# EAGLE schematic Test (EAGLE 7.7.0)
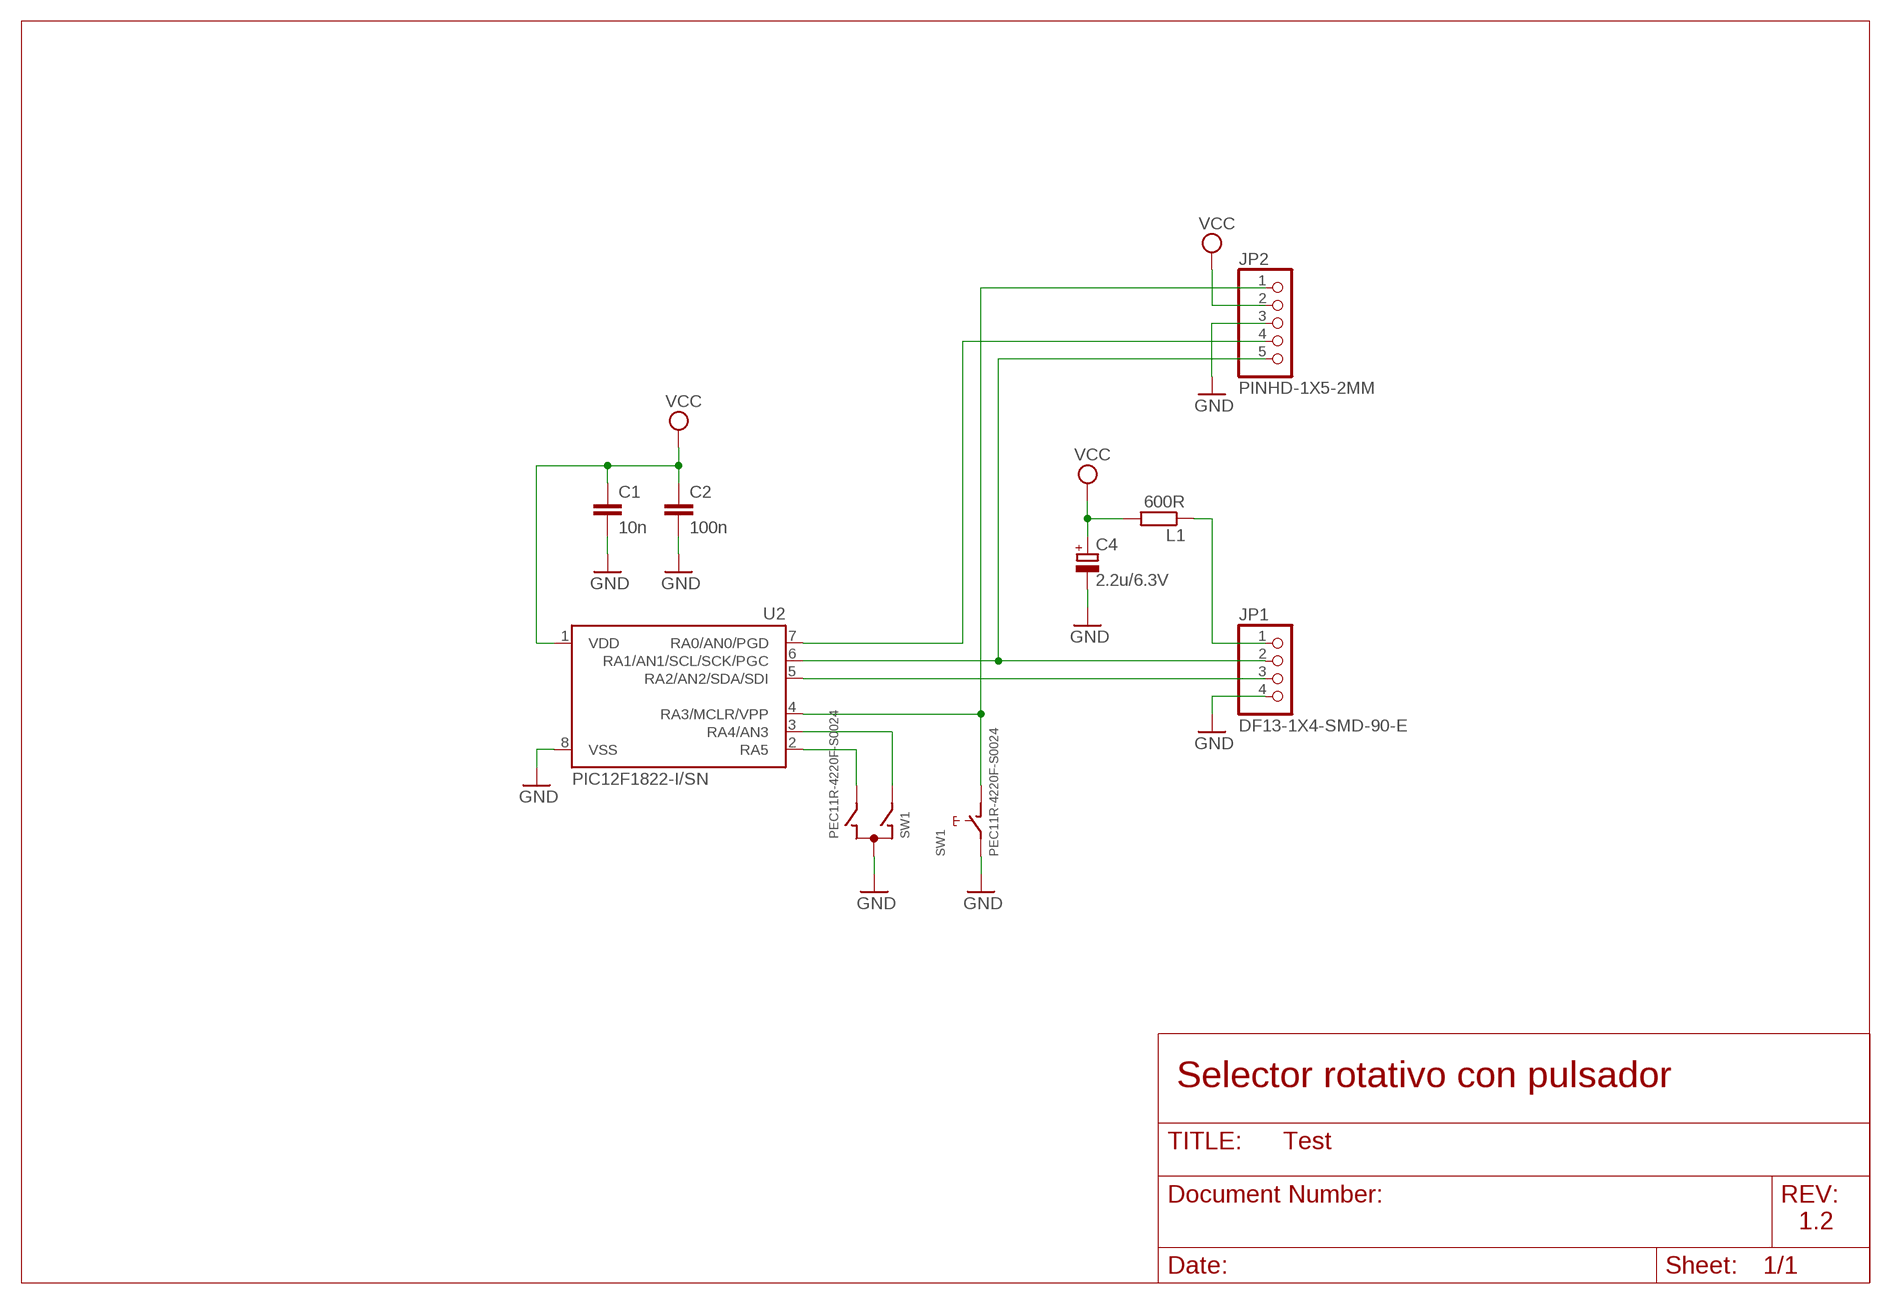
[diagram p0: schematic, sheet 1]

## Parts
C1  10n  C-EUC0805  [C0805]
C2  100n  C-EUC0805  [C0805]
C4  2.2u/6.3V  CPOL-EUSMCA  [SMC_A]
JP1  DF13-1X4-SMD-90-E  [1X4-SMD-90-E]
JP2  PINHD-1X5-2MM  [1X05-2MM]
L1  600R  R-EU_R0805  [R0805]
SW1  PEC11R-4220F-S0024  [PEC11R]
U2  PIC12F1822-I/SN  [SO08]

## Nets
GND: C1.2 C2.2 C4.- JP1.4 JP2.3 SW1.C SW1.E U2.8(VSS)
N$3: JP1.2 JP2.5 U2.6(RA1/AN1/SCL/SCK/PGC)
N$4: JP1.3 U2.5(RA2/AN2/SDA/SDI)
N$5: JP2.4 U2.7(RA0/AN0/PGD)
N$6 [VCC]: JP1.1 L1.1
N$7: SW1.B U2.2(RA5)
N$10: SW1.A U2.3(RA4/AN3)
N$12: JP2.1 SW1.D U2.4(RA3/MCLR/VPP)
VCC [VCC]: C1.1 C2.1 C4.+ JP2.2 L1.2 U2.1(VDD)
Unconnected: SW1.GND1(G) SW1.GND2(G)

## Notes on the sheet
- Selector rotativo con pulsador
- 1.2

## Library data of the parts
C1 C2 = rcl:C-EU: CAPACITOR, European symbol; PROVIDER: MOUSER
C4 = rcl:CPOL-EU: POLARIZED CAPACITOR, European symbol; PROVIDER: MOUSER
JP1 = hirose-df13:DF13-1X4: Conector Hirose DF13, 4 pin; MANUFACTURER: Hirose Electric; PROVIDER: MOUSER; REFERENCE: DF13-4P-1.25H(75)
JP2 = pinhead200:PINHD-1X5-2MM: Pin header 1x5 2mm pitch
L1 = rcl:R-EU_: RESISTOR, European symbol
SW1 = bourns:PEC11R: 12mm incremental encoder; MANUFACTURER: BOURNS; REFERENCE: PEC11R-4220F-S0024
U2 = microchip-pic:PIC12F1822: Microcontrolador PIC12F1822; MANUFACTURER: Microchip; REFERENCE: PIC12F1822-I/SN

## Net classes
0 default: width 0.15 mm
1 VCC: width 0.4 mm